# EAGLE design SmartMeter (EAGLE 5.10)
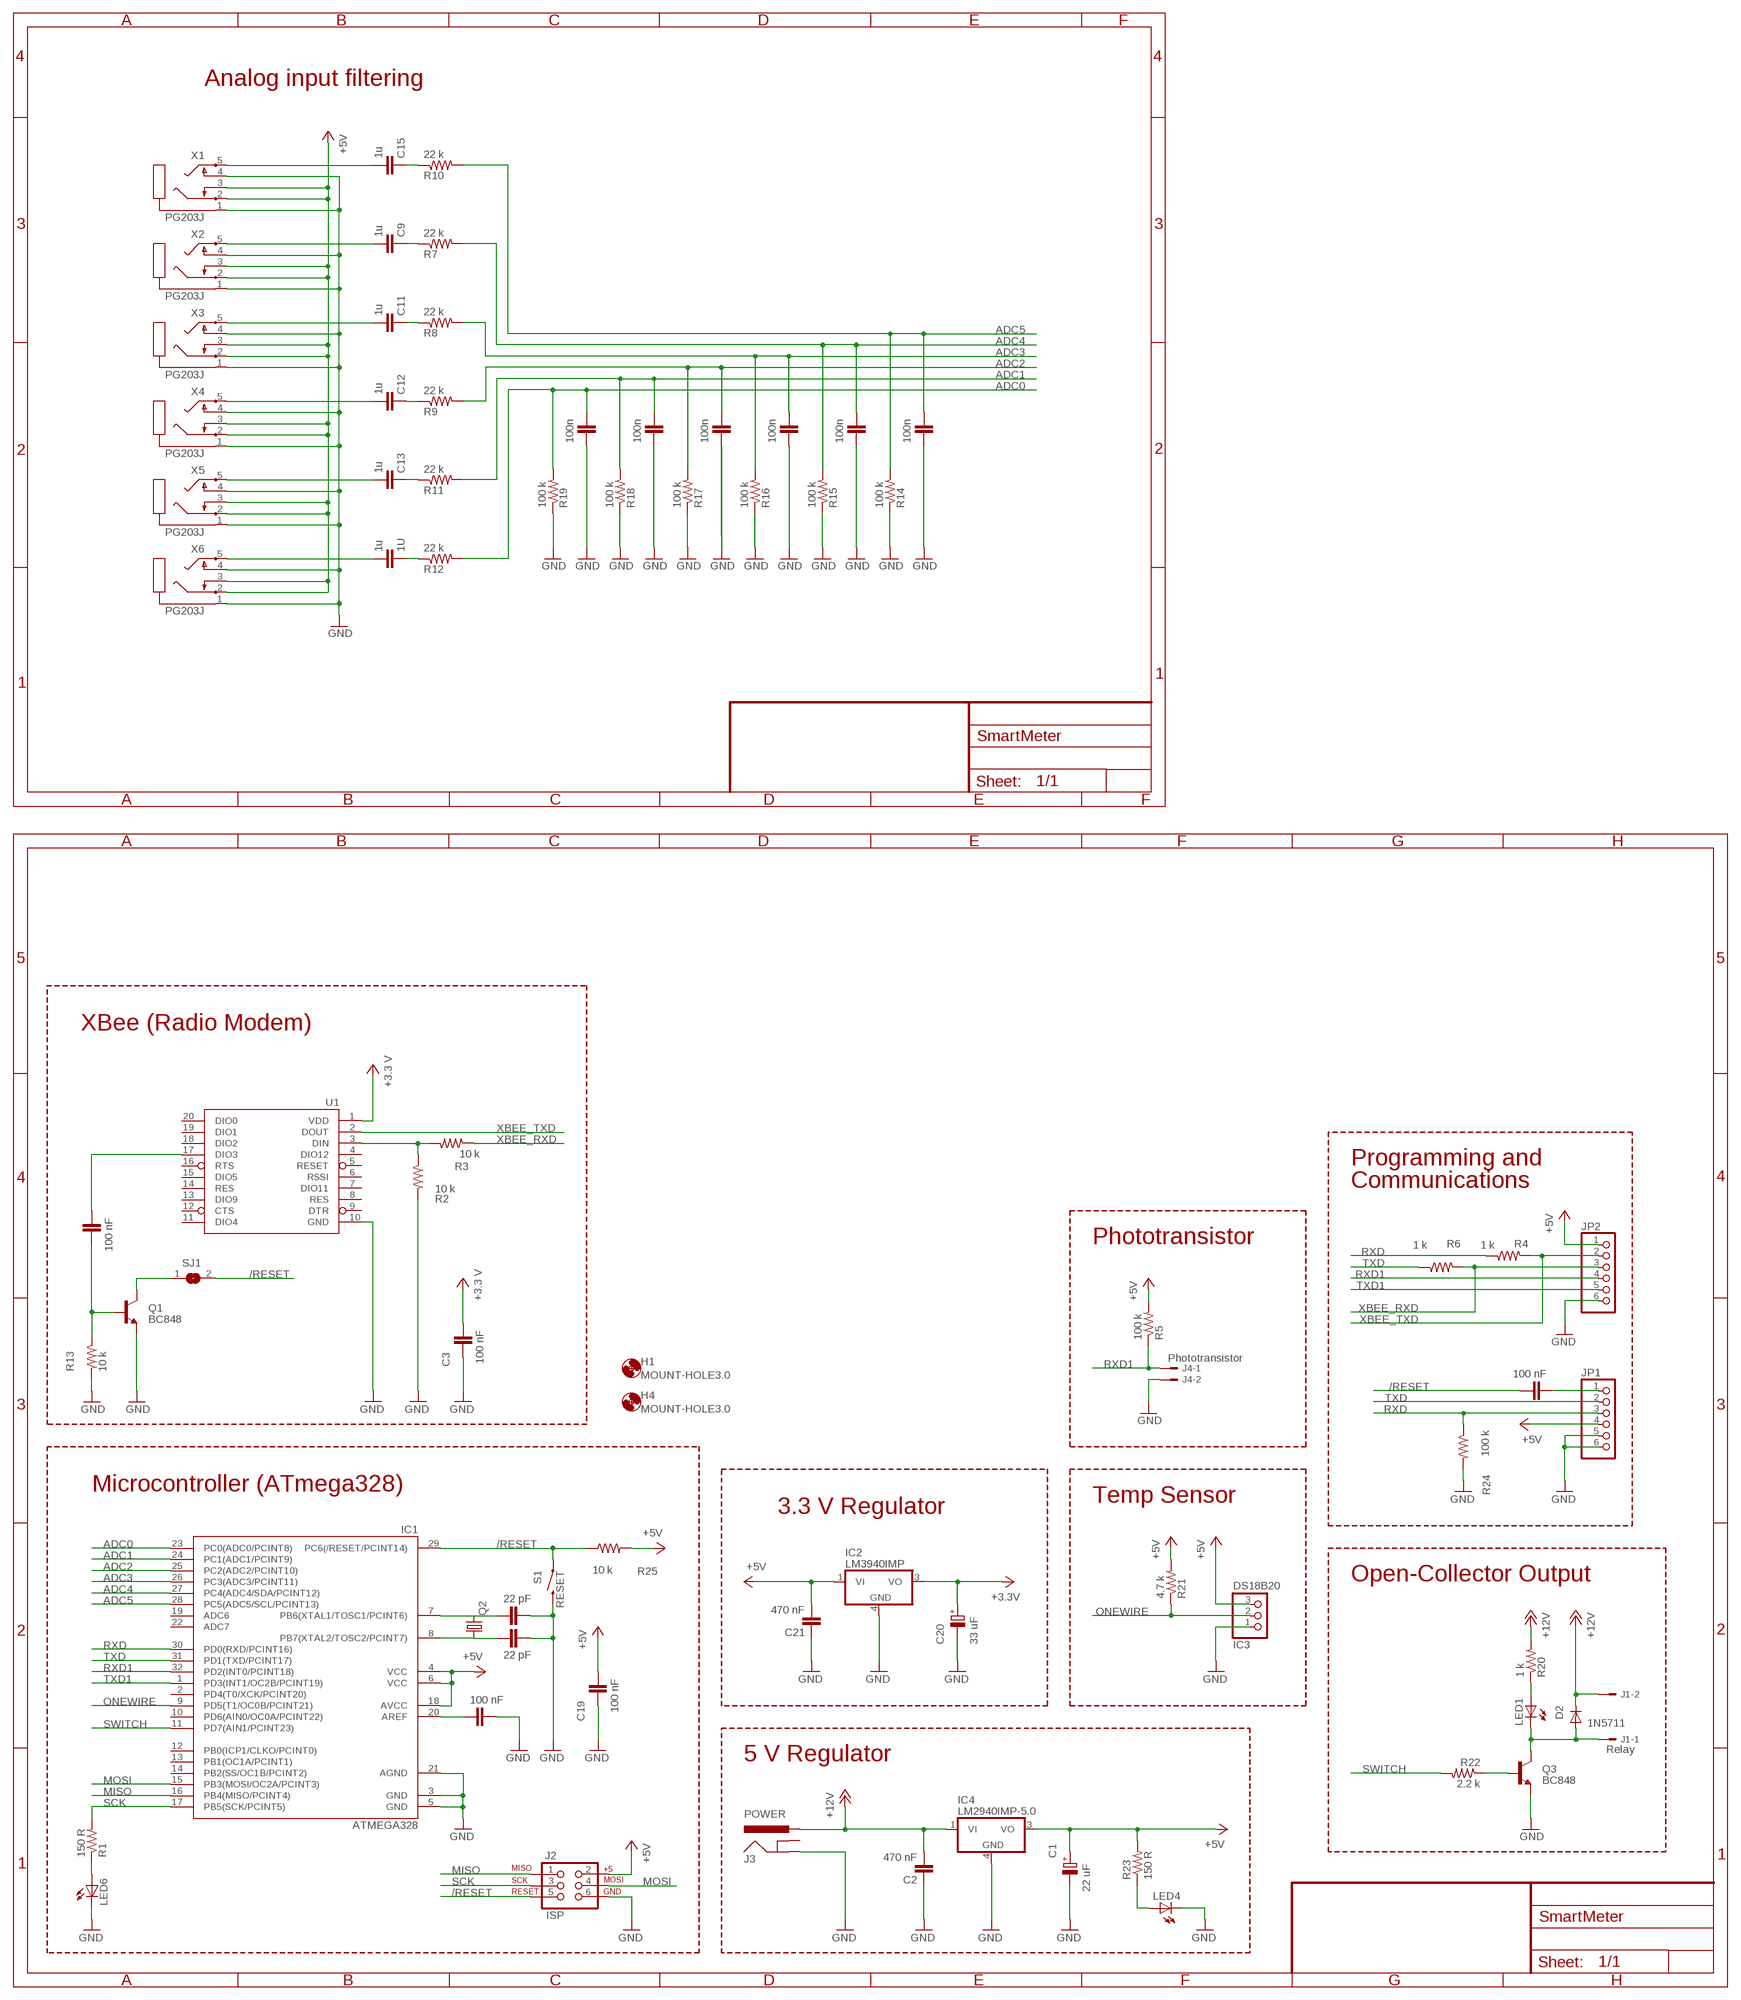
[diagram p0: schematic, sheet 1]

## Parts
1U  1u  C-EUC0805K  [C0805K]
100N  100n  C-EUC0805K  [C0805K]
C1  22 uF  CPOL-EUC/6032-28R  [C/6032-28R]
C2  470 nF  C-EUC0805K  [C0805K]
C3  100 nF  C-EUC0805K  [C0805K]
C4  100n  C-EUC0805K  [C0805K]
C5  100n  C-EUC0805K  [C0805K]
C6  100n  C-EUC0805K  [C0805K]
C7  100n  C-EUC0805K  [C0805K]
C8  100 nF  C-EUC0805K  [C0805K]
C9  1u  C-EUC0805K  [C0805K]
C10  100n  C-EUC0805K  [C0805K]
C11  1u  C-EUC0805K  [C0805K]
C12  1u  C-EUC0805K  [C0805K]
C13  1u  C-EUC0805K  [C0805K]
C14  100 nF  C-EUC0805K  [C0805K]
C15  1u  C-EUC0805K  [C0805K]
C16  100 nF  C-EUC0805K  [C0805K]
C17  22 pF  C-EUC0805K  [C0805K]
C18  22 pF  C-EUC0805K  [C0805K]
C19  100 nF  C-EUC0805K  [C0805K]
C20  33 uF  CPOL-EUC/6032-28R  [C/6032-28R]
C21  470 nF  C-EUC0805K  [C0805K]
D2  1N5711  DIODE-SOD123  [SOD123]
H1  MOUNT-HOLE3.0  [3,0]
H4  MOUNT-HOLE3.0  [3,0]
IC1  ATMEGA328  ATMEGA48/88/168-AU  [TQFP32-08]
IC2  LM3940IMP  LM340MP-05  [SOT223]
IC3  DS18B20  PINHD-1X3  [1X03]
IC4  LM2940IMP-5.0  LM340MP-05  [SOT223]
J1  Relay  22-23-2021  [22-23-2021]
J2  ISP  AVR_SPI_PRG_6PTH  [2X3]
J3  POWER  POWER_JACKPTH  [POWER_JACK_PTH]
J4  Phototransistor  22-23-2021  [22-23-2021]
JP1  PINHD-1X6  [1X06]
JP2  PINHD-1X6  [1X06]
LED1  LEDCHIP-LED0805  [CHIP-LED0805]
LED4  LEDCHIP-LED0805  [CHIP-LED0805]
LED6  LEDCHIP-LED0805  [CHIP-LED0805]
Q1  BC848  TRANSISTOR_NPNSOT23  [SOT23]
Q2  CRYSTALHC49UP  [HC49UP]
Q3  BC848  TRANSISTOR_NPNSOT23  [SOT23]
R1  150 R  R-US_M0805  [M0805]
R2  10 k  R-US_M0805  [M0805]
R3  10 k  R-US_M0805  [M0805]
R4  1 k  R-US_M0805  [M0805]
R5  100 k  R-US_M0805  [M0805]
R6  1 k  R-US_M0805  [M0805]
R7  22 k  R-US_M0805  [M0805]
R8  22 k  R-US_M0805  [M0805]
R9  22 k  R-US_M0805  [M0805]
R10  22 k  R-US_M0805  [M0805]
R11  22 k  R-US_M0805  [M0805]
R12  22 k  R-US_M0805  [M0805]
R13  10 k  R-US_M0805  [M0805]
R14  100 k  R-US_M0805  [M0805]
R15  100 k  R-US_M0805  [M0805]
R16  100 k  R-US_M0805  [M0805]
R17  100 k  R-US_M0805  [M0805]
R18  100 k  R-US_M0805  [M0805]
R19  100 k  R-US_M0805  [M0805]
R20  1 k  R-US_M0805  [M0805]
R21  4.7 k  R-US_M0805  [M0805]
R22  2.2 k  R-US_M0805  [M0805]
R23  150 R  R-US_M0805  [M0805]
R24  100 k  R-US_M0805  [M0805]
R25  10 k  R-US_M0805  [M0805]
S1  RESET  SWITCH-MOMENTARY-2SMD  [TACTILE_SWITCH_SMD]
SJ1  SJ  [SJ]
U1  XBEE-1B3  [XBEE-SMD]
X1  PG203J  [PG203J]
X2  PG203J  [PG203J]
X3  PG203J  [PG203J]
X4  PG203J  [PG203J]
X5  PG203J  [PG203J]
X6  PG203J  [PG203J]

## Nets
+3V3: C3.2 C20.+ IC2.3(VO) U1.1(VDD) ; supply symbol labelled +3.3 V, +3.3V
+5V: C1.+ C19.2 C21.2 IC1.4(VCC) IC1.6(VCC) IC1.18(AVCC) IC2.1(VI) IC3.3 IC4.3(VO) J2.2 JP1.4 JP2.1 R5.2 R21.2 R23.2 R25.2 X1.2 X1.3 X2.2 X2.3 X3.2 X3.3 X4.2 X4.3 X5.2 X5.3 X6.2 X6.3
+12V: C2.2 D2.C IC4.1(VI) J1.2 J3.PWR R20.2
/RESET: C14.1 IC1.29(PC6(/RESET/PCINT14)) J2.5 R25.1 S1.1 SJ1.2
ADC0: 100N.2 IC1.23(PC0(ADC0/PCINT8)) R12.2 R19.2
ADC1: C7.2 IC1.24(PC1(ADC1/PCINT9)) R11.2 R18.2
ADC2: C6.2 IC1.25(PC2(ADC2/PCINT10)) R9.2 R17.2
ADC3: C5.2 IC1.26(PC3(ADC3/PCINT11)) R8.2 R16.2
ADC4: C4.2 IC1.27(PC4(ADC4/SDA/PCINT12)) R7.2 R15.2
ADC5: C10.2 IC1.28(PC5(ADC5/SCL/PCINT13)) R10.2 R14.2
FOO: Q1.3(C) SJ1.1
GND: 100N.1 C1.- C2.1 C3.1 C4.1 C5.1 C6.1 C7.1 C8.1 C10.1 C17.1 C18.1 C19.1 C20.- C21.1 IC1.3(GND) IC1.5(GND) IC1.21(AGND) IC2.4(GND) IC3.1 IC4.4(GND) J2.6 J3.GND J4.2 JP1.5 JP1.6 JP2.6 LED4.C LED6.C Q1.2(E) Q3.2(E) R2.2 R13.2 R14.1 R15.1 R16.1 R17.1 R18.1 R19.1 R24.2 S1.3 U1.10(GND) X1.1 X1.4 X2.1 X2.4 X3.1 X3.4 X4.1 X4.4 X5.1 X5.4 X6.1 X6.4
MISO: IC1.16(PB4(MISO/PCINT4)) J2.1
MOSI: IC1.15(PB3(MOSI/OC2A/PCINT3)) J2.4
N$1: R1.2
N$3: LED1.A R20.1
N$4: D2.A J1.1 LED1.C Q3.3(C)
N$6: LED6.A R1.1
N$7: C16.2 U1.17(DIO3)
N$8: C14.2 JP1.1
N$9: Q3.1(B) R22.1
N$10: LED4.A R23.1
N$11: C8.2 IC1.20(AREF)
N$13: C18.2 IC1.8(PB7(XTAL2/TOSC2/PCINT7)) Q2.1
N$14: C17.2 IC1.7(PB6(XTAL1/TOSC1/PCINT6)) Q2.2
N$15: 1U.2 X6.5
N$16: C13.2 X5.5
N$17: C13.1 R11.1
N$20: 1U.1 R12.1
N$21: C9.2 X2.5
N$24: C15.2 X1.5
N$25: C12.1 R9.1
N$26: C12.2 X4.5
N$27: C11.1 R8.1
N$28: C9.1 R7.1
N$32: C11.2 X3.5
N$35: C15.1 R10.1
N$36: C16.1 Q1.1(B) R13.1
ONEWIRE: IC1.9(PD5(T1/OC0B/PCINT21)) IC3.2 R21.1
RXD: IC1.30(PD0(RXD/PCINT16)) JP1.3 R4.1 R24.1
RXD1: IC1.32(PD2(INT0/PCINT18)) J4.1 JP2.4 R5.1
SCK: IC1.17(PB5(SCK/PCINT5)) J2.3
SWITCH: IC1.11(PD7(AIN1/PCINT23)) R22.2
TXD: IC1.31(PD1(TXD/PCINT17)) JP1.2 R6.1
TXD1: IC1.1(PD3(INT1/OC2B/PCINT19)) JP2.5
XBEE_RX: R2.1 R3.2 U1.3(DIN)
XBEE_RXD: JP2.3 R3.1 R6.2
XBEE_TXD: JP2.2 R4.2 U1.2(DOUT)
Unconnected: IC1.2(PD4(T0/XCK/PCINT20)) IC1.10(PD6(AIN0/OC0A/PCINT22)) IC1.12(PB0(ICP1/CLKO/PCINT0)) IC1.13(PB1(OC1A/PCINT1)) IC1.14(PB2(SS/OC1B/PCINT2)) IC1.19(ADC6) IC1.22(ADC7) J3.GNDBREAK U1.4(DIO12) U1.5(RESET) U1.6(RSSI) U1.7(DIO11) U1.8(RES) U1.9(DTR) U1.11(DIO4) U1.12(CTS) U1.13(DIO9) U1.14(RES) U1.15(DIO5) U1.16(RTS) U1.18(DIO2) U1.19(DIO1) U1.20(DIO0)

## Notes on the sheet
- Analog input filtering
- XBee (Radio Modem)
- Programming and
- Communications
- Phototransistor
- Microcontroller (ATmega328)
- Temp Sensor
- 3.3 V Regulator
- Open-Collector Output
- 5 V Regulator

## Library data of the parts
1U 100N C2-C19 C21 = rcl:C-EU: CAPACITOR, European symbol
C1 C20 = rcl:CPOL-EU: POLARIZED CAPACITOR, European symbol
D2 = diode:DIODE-: DIODE
H1 H4 = holes:MOUNT-HOLE: MOUNTING HOLE with drill center marker
IC1 = atmega8:ATMEGA48/88/168
IC2 IC4 = linear:LM340?-*: Positive VOLTAGE REGULATOR Source: http://cache.national.com/ds/LM/LM340.pdf
IC3 = pinhead:PINHD-1X3: PIN HEADER
J1 J4 = con-molex:22-23-2021: .100" (2.54mm) Center Header - 2 Pin
J2 = SparkFun:AVR_SPI_PRG_6: AVR ISP 6 Pin This is the reduced ISP connector for AVR programming. Common on Arduino. This footprint will take up less PCB space and can be used with a 10-pin to 6-pin adapter such as SKU: BOB-08508
J3 = SparkFun:POWER_JACK: Power Jack This is the standard 5.5mm barrel jack for power. The PTH is the most common, proven, reliable, footprint. All others are experimental. The Slot footprint only works if the mill layer is transmitted to the PCB fab house so be warned. Spark Fun Electronics SKU : PRT-00119. Mating wall wart : TOL-00298 (and others)
JP1 JP2 = pinhead:PINHD-1X6: PIN HEADER
LED1 LED4 LED6 = led:LED: LED OSRAM: - CHIPLED LG R971, LG N971, LY N971, LG Q971, LY Q971, LO R971, LY R971 LH N974, LH R974 LS Q976, LO Q976, LY Q976 LO Q996 - Hyper CHIPLED LW Q18S LB Q993, LB Q99A, LB R99A - SideLED LS A670, LO A670, LY A670, LG A670, LP A670 LB A673, LV A673, LT A673, LW A673 LH A674 LY A675 LS A676, LA A676, LO A676, LY A676, LW A676 LS A679, LY A679, LG A679 - Hyper Micro SIDELED® LS Y876, LA Y876, LO Y876, LY Y876 LT Y87S - SmartLED LW L88C, LW L88S LB L89C, LB L89S, LG L890 LS L89K, LO L89K, LY L89K LS L896, LA L896, LO L896, LY L896 - TOPLED LS T670, LO T670, LY T670, LG T670, LP T670 LSG T670, LSP T670, LSY T670, LOP T670, LYG T670 LG T671, LOG T671, LSG T671 LB T673, LV T673, LT T673, LW T673 LH T674 LS T676, LA T676, LO T676, LY T676, LB T676, LH T676, LSB T676, LW T676 LB T67C, LV T67C, LT T67C, LS T67K, LO T67K, LY T67K, LW E67C LS E67B, LA E67B, LO E67B, LY E67B, LB E67C, LV E67C, LT E67C LW T67C LS T679, LY T679, LG T679 LS T770, LO T770, LY T770, LG T770, LP T770 LB T773, LV T773, LT T773, LW T773 LH T774 LS E675, LA E675, LY E675, LS T675 LS T776, LA T776, LO T776, LY T776, LB T776 LHGB T686 LT T68C, LB T68C - Hyper Mini TOPLED® LB M676 - Mini TOPLED Santana® LG M470 LS M47K, LO M47K, LY M47K Source: http://www.osram.convergy.de - LUMILED® LXK2-PW12-R00, LXK2-PW12-S00, LXK2-PW14-U00, LXK2-PW14-V00 LXK2-PM12-R00, LXK2-PM12-S00, LXK2-PM14-U00 LXK2-PE12-Q00, LXK2-PE12-R00, LXK2-PE12-S00, LXK2-PE14-T00, LXK2-PE14-U00 LXK2-PB12-K00, LXK2-PB12-L00, LXK2-PB12-M00, LXK2-PB14-N00, LXK2-PB14-P00, LXK2-PB14-Q00 LXK2-PR12-L00, LXK2-PR12-M00, LXK2-PR14-Q00, LXK2-PR14-R00 LXK2-PD12-Q00, LXK2-PD12-R00, LXK2-PD12-S00 LXK2-PH12-R00, LXK2-PH12-S00 LXK2-PL12-P00, LXK2-PL12-Q00, LXK2-PL12-R00 Source: www.luxeon.com
Q1 Q3 = SparkFun:TRANSISTOR_NPN: Transistor NPN BJT configuration in SOT23 package. MMBT2222 is the common NPN we use. Double check BCE configuration again layout.
Q2 = crystal:CRYSTAL: CRYSTAL
R1-R25 = rcl:R-US_: RESISTOR, American symbol
S1 = SparkFun:SWITCH-MOMENTARY-2
SJ1 = jumper:SJ: SMD solder JUMPER
U1 = xbee:XBEE-1
X1-X6 = con-hirschmann:PG203J: MIC/HEADPHONE JACK KS-S stereo microphone/headphone jack PG203JN (Schukat)

## Board
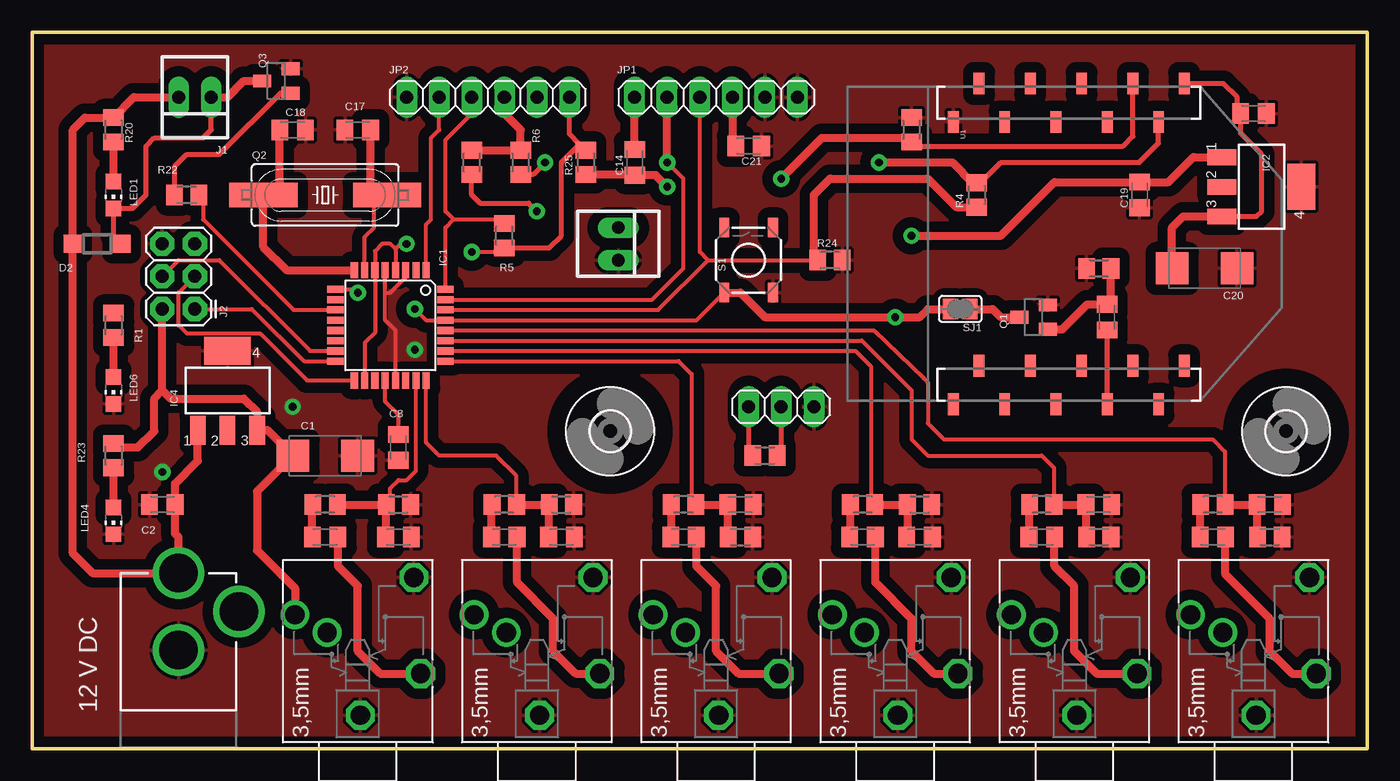
[diagram p1: board, top side]
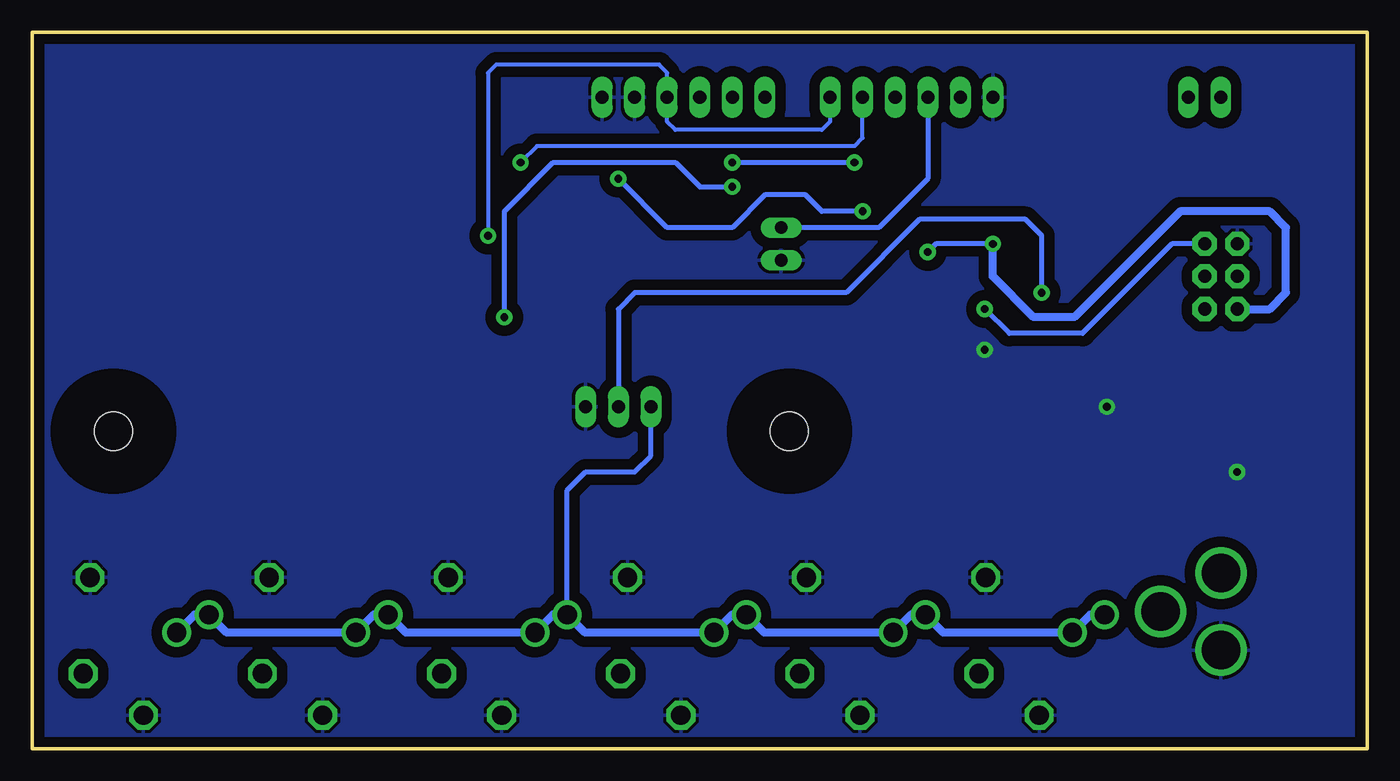
[diagram p2: board, bottom side, seen from below]

Size 104.14 x 55.88 mm. Coordinates in mm from the lower left corner, seen from the top.
Outline: 0,55.88 104.14,55.88 104.14,0 0,0 0,55.88
Copper layers (1*16): Top 0.035mm / dielectric 1.5mm / Bottom 0.035mm
Design rules "SparkFun": minimum track width 8mil, minimum drill 20mil, track to track 8mil, track to pad 8mil, pad to pad 8mil, via to via 8mil, smd to smd 8mil, copper to edge 10mil, drill to drill 8mil, minimum pad ring 12mil, minimum via ring 10mil, stop-mask expansion 4mil, vias tented up to drill 25mil, thermal gap 10mil

### Footprints (pad centres in the part's own frame; a part is rotated, then mirrored left to right if it is on the bottom)
C0805K = smd 1.3 x 1.6: 1 -1,0; 2 1,0
C/6032-28R = smd 2.55 x 2.5: + 2.525,0; - -2.525,0
SOD123 = smd 1.4 x 1.4: A 1.9,0; C -1.9,0
3,0 = hole 3: 0,0
TQFP32-08 = smd 1.27 x 0.559: 1 -4.293,2.8; 2 -4.293,2; 3 -4.293,1.2; 4 -4.293,0.4; 5 -4.293,-0.4; 6 -4.293,-1.2; 7 -4.293,-2; 8 -4.293,-2.8; 17 4.293,-2.8; 18 4.293,-2; 19 4.293,-1.2; 20 4.293,-0.4; 21 4.293,0.4; 22 4.293,1.2; 23 4.293,2; 24 4.293,2.8 | smd 0.559 x 1.27: 9 -2.8,-4.293; 10 -2,-4.293; 11 -1.2,-4.293; 12 -0.4,-4.293; 13 0.4,-4.293; 14 1.2,-4.293; 15 2,-4.293; 16 2.8,-4.293; 25 2.8,4.293; 26 2,4.293; 27 1.2,4.293; 28 0.4,4.293; 29 -0.4,4.293; 30 -1.2,4.293; 31 -2,4.293; 32 -2.8,4.293
SOT223 = smd 1.219 x 2.235: 1 -2.311,-3.099; 2 0,-3.099; 3 2.311,-3.099 | smd 3.6 x 2.2: 4 0,3.099
1X03 = drill 1.016 long: 1 -2.54,0; 2 0,0; 3 2.54,0
22-23-2021 = drill 1 long: 1 -1.27,0; 2 1.27,0
2X3 = drill 1.016 pad 1.88 octagon: 1 0,0; 2 0,2.54; 3 2.54,0; 4 2.54,2.54; 5 5.08,0; 6 5.08,2.54
POWER_JACK_PTH = drill 2.997 round: GND 0,7.7; GNDBREAK 4.7,10.7; PWR 0,13.7
1X06 = drill 1.016 long: 1 -6.35,0; 2 -3.81,0; 3 -1.27,0; 4 1.27,0; 5 3.81,0; 6 6.35,0
CHIP-LED0805 = smd 1.2 x 1.2: A 0,-1.05; C 0,1.05
SOT23 = smd 1 x 1.4: 1 -0.95,-1.1; 2 0.95,-1.1; 3 0,1.1
HC49UP = smd 5.334 x 1.93: 1 -4.826,0; 2 4.826,0
M0805 = smd 1.3 x 1.6: 1 -0.95,0; 2 0.95,0
TACTILE_SWITCH_SMD = smd 1.524 x 0.762: 1 -2.54,1.905; 2 2.54,1.905; 3 -2.54,-1.905; 4 2.54,-1.905
SJ = smd 1.168 x 1.6: 1 -0.762,0; 2 0.762,0
XBEE-SMD = smd 1.7 x 0.85: 1 -12.5,20; 2 -9.5,18; 3 -12.5,16; 4 -9.5,14; 5 -12.5,12; 6 -9.5,10; 7 -12.5,8; 8 -9.5,6; 9 -12.5,4; 10 -9.5,2; 11 12.5,2; 12 9.5,4; 13 12.5,6; 14 9.5,8; 15 12.5,10; 16 9.5,12; 17 12.5,14; 18 9.5,16; 19 12.5,18; 20 9.5,20
PG203J = drill 1.499 octagon: 1 -5.004,-0.203; 4 5.74,-4.369; 5 -1.753,-4.902 | drill 1.499 round: 2 2.845,4.902; 3 1.448,2.388

### Placement (x,y rotation side)
1U  22.86,16.51 0 top
100N  28.57,16.51 180 top
C1  22.86,22.86 180 top
C2  10.16,19.05 0 top
C3  95.25,49.53 180 top
C4  83.19,19.05 180 top
C5  69.22,16.51 180 top
C6  55.24,19.05 180 top
C7  41.27,16.51 180 top
C8  28.57,23.5 90 top
C9  78.74,16.51 0 top
C10  96.52,19.05 180 top
C11  64.77,16.51 0 top
C12  50.8,16.51 0 top
C13  36.83,16.51 0 top
C14  46.99,45.72 90 top
C15  92.08,16.51 0 top
C16  83.82,33.66 270 top
C17  25.4,48.26 0 top
C18  20.32,48.26 180 top
C19  86.36,43.18 90 top
C20  91.44,37.47 180 top
C21  55.88,46.99 180 top
D2  5.08,39.37 0 top
H1  45.09,24.77 0 top
H4  97.79,24.77 0 top
IC1  27.94,33.02 270 top
IC2  95.89,43.81 270 top
IC3  58.42,26.67 180 top
IC4  15.24,27.94 0 top
J1  12.7,50.8 180 top
J2  12.7,34.29 90 top
J3  11.43,0 0 top
J4  45.72,39.37 270 top
JP1  53.34,50.8 0 top
JP2  35.56,50.8 180 top
LED1  6.35,43.18 180 top
LED4  6.35,17.78 180 top
LED6  6.35,27.94 180 top
Q1  78.11,33.66 90 top
Q2  22.86,43.18 0 top
Q3  19.05,52.07 90 top
R1  6.35,33.02 90 top
R2  68.58,48.26 90 top
R3  34.29,45.72 270 top
R4  73.66,43.18 90 top
R5  36.83,40.01 270 top
R6  38.1,45.72 90 top
R7  78.74,19.05 0 top
R8  64.77,19.05 0 top
R9  50.8,19.05 0 top
R10  92.08,19.05 0 top
R11  36.83,19.05 0 top
R12  22.86,19.05 0 top
R13  83.19,37.47 180 top
R14  96.52,16.51 180 top
R15  83.19,16.51 180 top
R16  69.22,19.05 180 top
R17  55.24,16.51 180 top
R18  41.27,19.05 180 top
R19  28.57,19.05 180 top
R20  6.35,48.26 90 top
R21  57.15,22.86 180 top
R22  12.06,43.18 0 top
R23  6.35,22.86 90 top
R24  62.23,38.1 0 top
R25  43.18,45.72 90 top
S1  55.88,38.1 90 top
SJ1  72.39,34.29 180 top
U1  69.85,39.37 270 top
X1  95.25,7.62 90 top
X2  81.28,7.62 90 top
X3  67.31,7.62 90 top
X4  53.34,7.62 90 top
X5  39.37,7.62 90 top
X6  25.4,7.62 90 top

### Tracks (layer width: path | path; a pad name or v marks a point on that pad's centre or on a via)
+3V3
  Top 0.305: C3.2 93.98,49.8
  Top 0.406: U1.1 92.91,51.87 93.98,50.8 93.98,49.8 | IC2.3 95.48,41.5 95.89,41.91 95.89,46.36 94.25,47.99 C3.2
  Top 0.61: IC2.3 89.76,41.5 88.9,40.64 C20.+
+5V  (via drill 0.6 pad 1.27)
  Top 0.305: IC1.18 25.94,31.66 26.74,32.45 IC1.6 26.74,38.8 27.3,39.37 27.94,39.37 28.34,38.97 | 28.34,38.97 IC1.4 | v29.21,39.37 28.74,39.37 28.34,38.97 | v34.29,38.73 36.51,38.73 R5.2 | 55.88,23.18 R21.2 | 54.61,47.26 C21.2
  Top 0.406: IC3.3 55.88,23.18 | 42.7,47.15 41.91,47.94 JP2.1 | 42.7,47.15 R25.2 | R5.2 40.33,39.05 41.27,40.01 41.27,45.72 42.7,47.15
  Top 0.61: X6.2 20.5,12.52 17.55,15.47 17.55,20.08 C1.+ 18.35,24.84 IC4.3 17.55,26.26 16.51,27.3 10.79,27.3 10.16,27.94 | 10.16,27.94 J2.2 | 10.16,27.94 9.53,27.3 9.53,24.77 8.26,23.5 6.67,23.5 R23.2 | JP1.4 54.61,47.26 | v68.58,40.01 75.56,40.01 79.74,44.18 C19.2 88.63,44.18 90.58,46.13 IC2.1
  Bottom 0.305: JP2.1 41.91,48.9 42.55,48.26 53.98,48.26 54.61,48.9 JP1.4 54.61,52.7 55.24,53.34 67.94,53.34 68.58,52.7 v68.58,40.01
  Bottom 0.406: v29.21,39.37 33.66,39.37 v34.29,38.73 | IC3.3 55.88,22.86 57.15,21.59 60.96,21.59 62.41,20.14 X3.2
  Bottom 0.61: X6.2 21.61,10.46 X6.3 33.07,9.07 X5.2 35.59,10.46 X5.3 47.04,9.07 X4.2 49.55,10.46 X4.3 61.01,9.07 X3.2 63.52,10.46 X3.3 74.98,9.07 X2.2 77.5,10.46 X2.3 88.95,9.07 X1.2 91.47,10.46 X1.3 | J2.2 7.62,34.29 6.35,35.56 6.35,40.64 7.62,41.91 14.61,41.91 22.86,33.66 26.04,33.66 29.21,36.83 v29.21,39.37
+12V
  Top 0.305: 3.17,48.26 D2.C
  Top 0.61: J1.2 7.94,50.8 R20.2 4.12,49.21 3.17,48.26 3.17,15.24 4.71,13.7 J3.PWR 11.43,16.51 11.16,16.78 C2.2 11.16,20.69 12.93,22.45 IC4.1 12.85,24.77
/RESET  (via drill 0.6 pad 1.27)
  Top 0.305: v29.84,34.29 30.71,33.42 IC1.29 51.84,33.42 S1.1 | C14.1 46.94,44.77
  Top 0.61: SJ1.2 69.85,34.29 69.22,33.66 v67.31,33.66 57.15,33.66 55.24,35.56 S1.1 | 46.94,44.77 R25.1 | C14.1 48.62,44.72 v49.53,43.81
  Bottom 0.406: J2.5 15.24,39.37 22.23,32.38 27.94,32.38 v29.84,34.29 | v49.53,43.81 52.07,43.81 53.98,45.72 63.5,45.72 67.31,41.91 v67.31,33.66
ADC0
  Top 0.305: 27.57,19 R19.2 27.94,19.37 27.94,20.32 28.57,20.96 29.21,20.96 29.94,21.69 IC1.23
  Top 0.61: R12.2 R19.2 | 27.57,19 100N.2
ADC1
  Top 0.305: R11.2 37.78,21.28 36.2,22.86 31.75,22.86 30.74,23.87 IC1.24 | R18.2 40.27,19
  Top 0.61: R11.2 R18.2 | 40.27,19 C7.2
ADC2
  Top 0.305: IC1.25 50.42,30.22 51.44,29.21 51.44,19.37 R9.2 | 54.24,16.56 R17.2
  Top 0.61: R9.2 C6.2 54.24,16.56
ADC3
  Top 0.305: IC1.26 64.23,31.02 65.41,29.84 65.41,19.37 R8.2 | 68.27,16.56 C5.2
  Top 0.61: R8.2 R16.2 68.27,16.56
ADC4
  Top 0.305: R7.2 79.69,21.91 78.74,22.86 69.85,22.86 68.58,24.13 68.58,27.94 64.7,31.82 IC1.27 | 82.19,16.56 R15.2
  Top 0.61: R7.2 C4.2 82.19,16.56
ADC5
  Top 0.305: R10.2 93.03,23.18 92.08,24.13 71.12,24.13 69.85,25.4 69.85,28.57 69.53,28.89 65.64,32.62 IC1.28 | 95.52,16.56 R14.2
  Top 0.61: R10.2 C10.2 95.52,16.56
FOO
  Top 0.61: SJ1.1 74.93,34.29 75.56,33.66 Q1.3
GND  (via drill 0.6 pad 1.27)
  Top 0.305: 27.54,35.56 27.54,33.42 28.34,32.62 IC1.21 | 27.54,35.56 IC1.5 | IC1.3 29.14,36.76 27.94,35.56 27.54,35.56
  Top 0.406: C1.- 25.4,22.86
  other vias: 20.32,26.67 29.84,31.12 10.16,21.59
  pour Bottom (isolate 0.813): -6.99,67.31 106.05,67.31 105.41,0 -7.62,0
  pour Top (isolate 0.813): -7.62,67.31 105.41,67.31 105.41,0 -7.62,0
MISO
  Top 0.305: IC1.16 21.21,30.22 17.14,34.29 J2.1
MOSI
  Top 0.305: IC1.15 21.68,31.02 14.61,38.1 11.43,38.1 J2.4
N$3
  Top 0.61: LED1.A R20.1
N$4
  Top 0.406: J1.1 13.97,48.26 13.34,47.62 9.53,47.62 8.89,46.99 8.89,43.18 7.84,42.13 LED1.C 6.35,40 D2.A
  Top 0.61: Q3.3 16.51,52.07 15.24,50.8 J1.1
N$5  (via drill 0.6 pad 1.27)
  other vias: 40.01,45.72
N$6
  Top 0.61: LED6.A R1.1
N$7
  Top 0.406: U1.17 83.85,32.62
  Top 0.61: 83.85,32.62 C16.2
N$8
  Top 0.61: C14.2 JP1.1
N$9
  Top 0.406: R22.1 11.12,45.41 12.06,46.36 14.61,46.36 19.37,51.12 Q3.1
N$10
  Top 0.61: LED4.A R23.1
N$11
  Top 0.305: IC1.20 27.54,27.07 28.57,26.04 C8.2
N$12  (via drill 0.6 pad 1.27)
  other vias: 58.42,44.45
N$13
  Top 0.406: 19.32,44.18 20.32,43.18 Q2.1
  Top 0.61: Q2.1 18.03,39.12 19.84,37.31 IC1.8 | 19.32,44.18 C18.2
N$14
  Top 0.305: IC1.7 25.94,39.91 26.67,40.64 26.67,43.18
  Top 0.406: Q2.2 26.67,43.18 26.4,43.45
  Top 0.61: 26.4,43.45 C17.2
N$15
  Top 0.61: X6.5 27.15,5.87 25.4,7.62 25.4,12.7 23.86,14.24 1U.2
N$16
  Top 0.61: X5.5 42.39,5.87 40.64,7.62 40.64,10.16 37.83,12.97 C13.2
N$17
  Top 0.305: 35.83,19 R11.1
  Top 0.61: C13.1 35.83,19
N$19  (via drill 0.6 pad 1.27)
  other vias: 49.53,43.81
N$20
  Top 0.305: 21.86,19 R12.1
  Top 0.61: 1U.1 21.86,19
N$21
  Top 0.61: X2.5 83.03,5.87 81.28,7.62 81.28,12.7 79.74,14.24 C9.2
N$24
  Top 0.61: X1.5 98.27,5.87 96.52,7.62 96.52,10.16 93.08,13.61 C15.2
N$25
  Top 0.305: C12.1 49.85,16.56
  Top 0.61: 49.85,16.56 R9.1
N$26
  Top 0.61: X4.5 55.09,5.87 53.34,7.62 53.34,12.7 51.8,14.24 C12.2
N$27
  Top 0.305: C11.1 63.82,16.56
  Top 0.61: 63.82,16.56 R8.1
N$28
  Top 0.305: C9.1 77.79,16.56
  Top 0.61: 77.79,16.56 R7.1
N$32
  Top 0.61: X3.5 70.33,5.87 68.58,7.62 68.58,10.16 65.77,12.97 C11.2
N$35
  Top 0.305: C15.1 91.12,16.56
  Top 0.61: 91.12,16.56 R10.1
N$36
  Top 0.305: C16.1 84.14,34.97
  Top 0.61: Q1.1 80.33,32.7 82.28,34.66 C16.1 | 84.14,34.97 R13.1
ONEWIRE  (via drill 0.6 pad 1.27)
  Top 0.305: IC1.9 25.14,35.82 v25.4,35.56 | 58.42,23.18 R21.1
  Top 0.406: IC3.2 58.42,23.18
  Bottom 0.406: v25.4,35.56 25.4,40.01 26.67,41.27 34.92,41.27 40.64,35.56 57.15,35.56 58.42,34.29 IC3.2
RXD
  Top 0.305: IC1.30 48.83,34.22 52.7,38.1 | 52.7,38.1 52.07,38.73 JP1.3 | 52.7,38.1 60.96,38.1 R24.1
  Top 0.61: R4.1 72.07,42.23 69.85,44.45 62.23,44.45 60.96,43.18 60.96,38.1
RXD1
  Top 0.305: R5.1 37.15,41.27 32.87,41.27 | JP2.4 34.29,49.53 32.23,47.47 32.23,41.91 32.87,41.27 | IC1.32 32.23,40.64 32.87,41.27
  Bottom 0.406: J4.1 38.1,40.64 34.29,44.45 JP2.4
SCK
  Top 0.305: IC1.17 21.44,28.73 17.78,32.38 12.06,32.38 11.43,33.02 11.43,35.56 J2.3
SWITCH
  Top 0.305: IC1.11 20.39,34.22 13.34,41.27 13.34,42.86 R22.2
TXD  (via drill 0.6 pad 1.27)
  Top 0.305: IC1.31 48.35,35.02 50.8,37.47 50.8,44.45 v49.53,45.72
  Top 0.406: R6.1 39.05,44.77 v40.01,45.72
  Top 0.61: v49.53,45.72 JP1.2
  Bottom 0.406: v49.53,45.72 v40.01,45.72
TXD1
  Top 0.305: JP2.5 31.75,48.26 31.11,47.62 31.11,41.27 30.74,40.9 IC1.1
XBEE_RX  (via drill 0.6 pad 1.27)
  Top 0.305: 68.9,46.99 R2.1 68.27,47.62
  Top 0.406: U1.3 85.85,47.75 85.09,46.99 68.9,46.99 | R3.2 34.29,43.18 34.92,42.55 38.73,42.55 v39.37,41.91
  Top 0.61: v58.42,44.45 61.59,47.62 68.27,47.62
  Bottom 0.406: v39.37,41.91 42.55,41.91 43.81,43.18 46.99,43.18 49.53,40.64 54.61,40.64 v58.42,44.45
XBEE_RXD
  Top 0.61: JP2.3 36.83,49.53 38.1,48.26 R6.2 R3.1
XBEE_TXD  (via drill 0.6 pad 1.27)
  Top 0.305: 73.97,44.13 R4.2 73.34,44.13
  Top 0.406: U1.2 87.85,47.21 86.36,45.72 75.56,45.72 73.97,44.13
  Top 0.61: 73.34,44.13 71.75,45.72 v66.04,45.72
  Bottom 0.305: JP2.2 39.37,47.62 40.01,46.99 64.77,46.99 v66.04,45.72

### Text on the board
tPlace: 12 V DC